# Altium schematic sheet P04 Pin MAP.SchDoc
size 420 x 297 mm
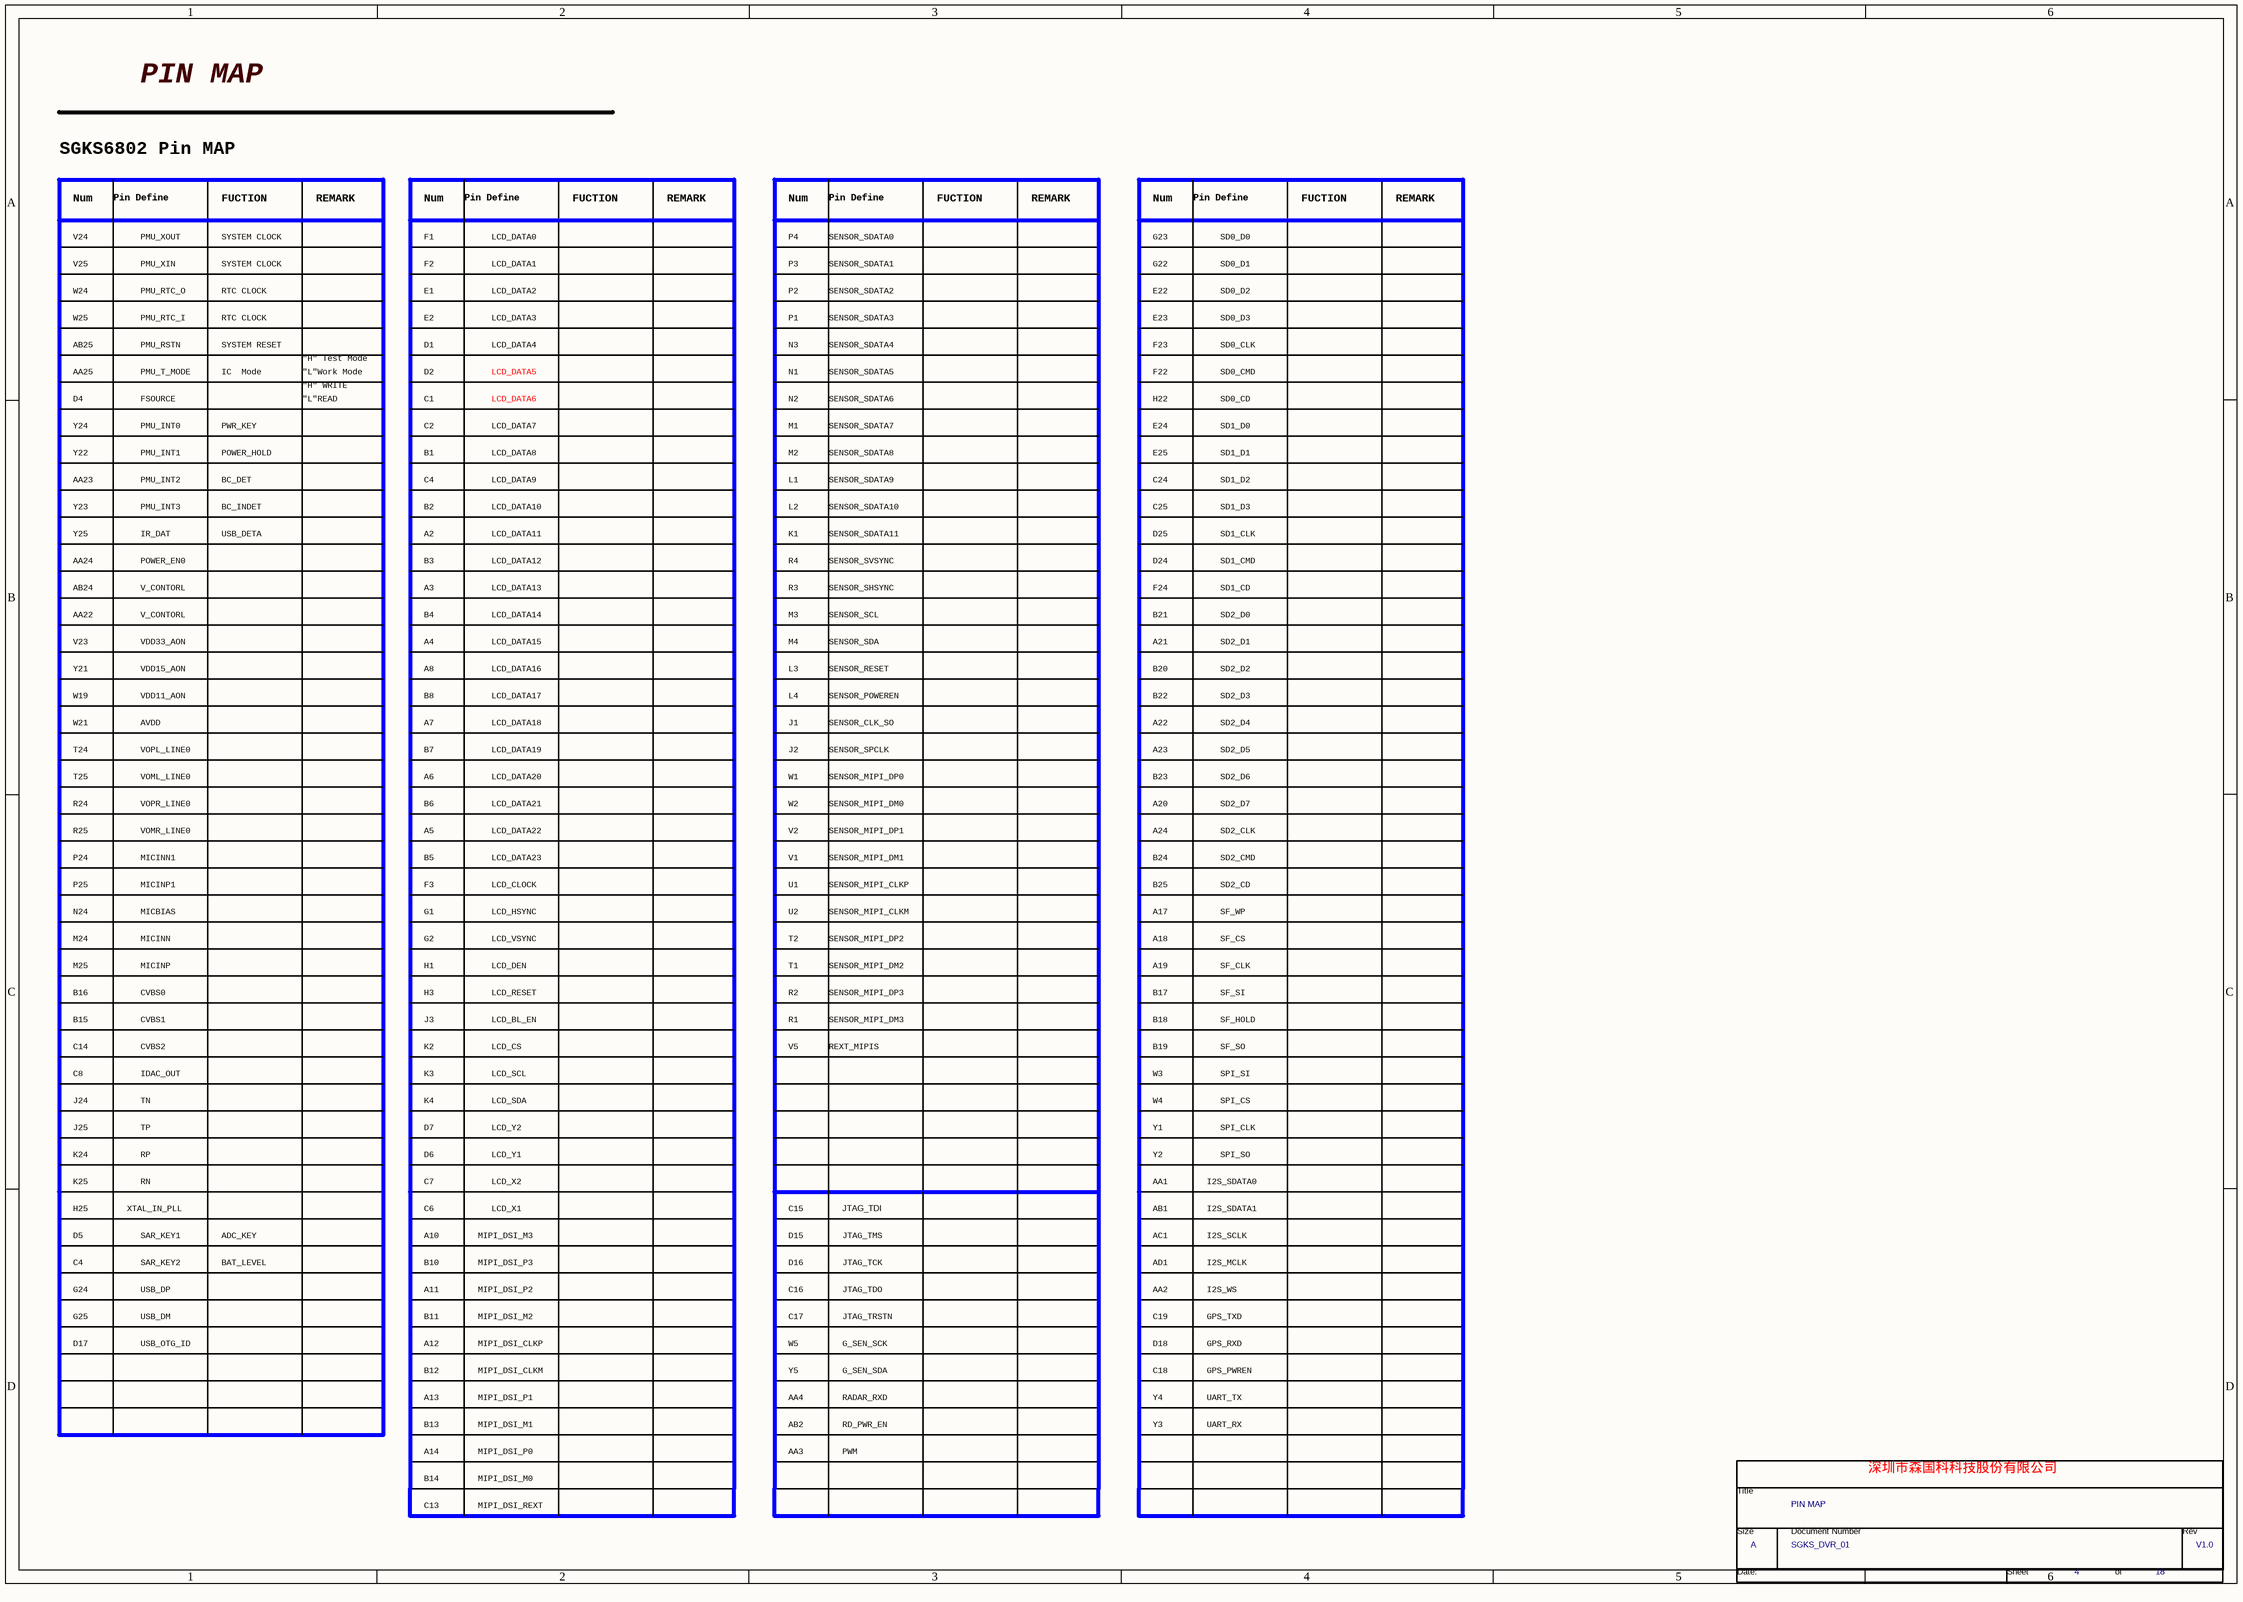
[diagram p0: P04 Pin MAP.SchDoc]

## Parts
*  Page Count: 18  Page Number: 4  Page Size: A  Title: PIN MAP  RevCode: V1.0  Doc: SGKS_DVR_01  (hidden comment: TitleBlock0)  (graphical)

## Notes on the sheet
- PIN MAP
- SGKS6802 Pin MAP
- Num
- V24
- Pin Define
- PMU_XOUT
- SYSTEM CLOCK
- FUCTION
- REMARK
- F1
- LCD_DATA0
- P4
- SENSOR_SDATA0
- G23
- SD0_D0
- V25
- W24
- W25
- PMU_RTC_I
- PMU_RTC_O
- PMU_XIN
- RTC CLOCK
- F2
- E1
- E2
- LCD_DATA3
- LCD_DATA2
- LCD_DATA1
- P3
- P2
- P1
- SENSOR_SDATA1
- SENSOR_SDATA2
- SENSOR_SDATA3
- G22
- E22
- E23
- SD0_D3
- SD0_D2
- SD0_D1
- AB25
- AA25
- PMU_T_MODE
- PMU_RSTN
- IC  Mode
- SYSTEM RESET
- "H" Test Mode
- "L"Work Mode
- "H" WRITE
- D1
- D2
- LCD_DATA4
- LCD_DATA5
- N3
- N1
- SENSOR_SDATA4
- SENSOR_SDATA5
- F23
- F22
- SD0_CLK
- SD0_CMD
- D4
- Y24
- Y22
- PMU_INT1
- FSOURCE
- PMU_INT0
- PWR_KEY
- POWER_HOLD
- "L"READ
- C1
- C2
- B1
- LCD_DATA8
- LCD_DATA7
- LCD_DATA6
- N2
- M1
- M2
- SENSOR_SDATA6
- SENSOR_SDATA7
- SENSOR_SDATA8
- H22
- E24
- E25
- SD1_D1
- SD1_D0
- SD0_CD
- AA23
- Y23
- PMU_INT3
- PMU_INT2
- BC_DET
- BC_INDET
- C4
- B2
- LCD_DATA9
- LCD_DATA10
- L1
- L2
- SENSOR_SDATA9
- SENSOR_SDATA10
- C24
- C25
- SD1_D2
- SD1_D3
- Y25
- AA24
- AB24
- POWER_EN0
- IR_DAT
- V_CONTORL
- USB_DETA
- A2
- B3
- A3
- LCD_DATA11
- LCD_DATA12
- LCD_DATA13
- K1
- R4
- R3
- SENSOR_SDATA11
- SENSOR_SVSYNC
- SENSOR_SHSYNC
- D25
- D24
- F24
- SD1_CLK
- SD1_CMD
- SD1_CD
- AA22
- V23
- VDD33_AON
- B4
- A4
- LCD_DATA15
- LCD_DATA14
- M3
- M4
- SENSOR_SCL
- SENSOR_SDA
- B21
- A21
- SD2_D1
- SD2_D0
- Y21
- W19
- W21
- AVDD
- VDD15_AON
- VDD11_AON
- A8
- B8
- A7
- LCD_DATA16
- LCD_DATA17
- LCD_DATA18
- L3
- L4
- J1
- SENSOR_CLK_SO
- SENSOR_POWEREN
- SENSOR_RESET
- B20
- B22
- A22
- SD2_D2
- SD2_D3
- SD2_D4
- T24
- T25
- VOML_LINE0
- VOPL_LINE0
- B7
- A6
- LCD_DATA19
- LCD_DATA20
- J2
- W1
- SENSOR_MIPI_DP0
- SENSOR_SPCLK
- A23
- B23
- SD2_D5
- SD2_D6
- R24
- R25
- P24
- VOMR_LINE0
- VOPR_LINE0
- MICINN1
- B6
- A5
- B5
- LCD_DATA21
- LCD_DATA22
- LCD_DATA23
- W2
- V2
- V1
- SENSOR_MIPI_DP1
- SENSOR_MIPI_DM1
- SENSOR_MIPI_DM0
- A20
- A24
- B24
- SD2_D7
- SD2_CLK
- SD2_CMD
- P25
- N24
- MICINP1
- MICBIAS
- F3
- G1
- LCD_HSYNC
- LCD_CLOCK
- U1
- U2
- SENSOR_MIPI_CLKP
- SENSOR_MIPI_CLKM
- B25
- A17
- SF_WP
- SD2_CD
- M24
- M25
- B16
- MICINN
- MICINP
- CVBS0
- G2
- H1
- H3
- LCD_VSYNC
- LCD_DEN
- LCD_RESET
- T2
- T1
- R2
- SENSOR_MIPI_DP2
- SENSOR_MIPI_DM2
- SENSOR_MIPI_DP3
- A18
- A19
- B17
- SF_CS
- SF_CLK
- SF_SI
- B15
- C14
- CVBS1
- CVBS2
- J3
- K2
- LCD_BL_EN
- LCD_CS
- R1
- V5
- SENSOR_MIPI_DM3
- REXT_MIPIS
- B18
- B19
- SF_HOLD
- SF_SO
- C8
- J24
- J25
- IDAC_OUT
- TN
- TP
- K3
- K4
- D7
- LCD_SCL
- LCD_SDA
- LCD_Y2
- W3
- W4
- Y1
- SPI_SI
- SPI_CS
- SPI_CLK
- K24
- K25
- RP
- RN
- D6
- C7
- LCD_Y1
- LCD_X2
- Y2
- AA1
- I2S_SDATA0
- SPI_SO
- H25
- D5
- XTAL_IN_PLL
- SAR_KEY1
- SAR_KEY2
- ADC_KEY
- BAT_LEVEL
- A10
- B10
- C6
- MIPI_DSI_M3
- MIPI_DSI_P3
- LCD_X1
- D15
- D16
- C15
- JTAG_TMS
- JTAG_TCK
- JTAG_TDI
- AC1
- AD1
- AB1
- I2S_SCLK
- I2S_MCLK
- I2S_SDATA1
- G24
- G25
- USB_DP
- USB_DM
- A11
- B11
- MIPI_DSI_P2
- MIPI_DSI_M2
- C16
- C17
- JTAG_TDO
- JTAG_TRSTN
- AA2
- C19
- I2S_WS
- GPS_TXD
- D17
- USB_OTG_ID
- A12
- B12
- A13
- MIPI_DSI_CLKP
- MIPI_DSI_CLKM
- MIPI_DSI_P1
- W5
- Y5
- AA4
- G_SEN_SCK
- G_SEN_SDA
- RADAR_RXD
- D18
- C18
- Y4
- GPS_RXD
- GPS_PWREN
- UART_TX
- B13
- A14
- MIPI_DSI_M1
- MIPI_DSI_P0
- AB2
- AA3
- RD_PWR_EN
- PWM
- Y3
- UART_RX
- 深圳市森国科科技股份有限公司
- B14
- C13
- MIPI_DSI_M0
- MIPI_DSI_REXT
- (in symbol TitleBlock0) Title; Size; Document Number; Rev; Date:; Sheet; of

## Library data of the parts
* = TitleBlock0: Page Create Date: March  8, 1995